# Altium schematic sheet USB_TYPEC_Connector.SchDoc
size A3; Date: 07.08.2025; CheckedBy: Own Check; CompanyName: No Company; DocumentNumber: ELK.PCB.0005.0005.A.A; Revision: V0.0.1; SheetNumber: 16; SheetTotal: 22
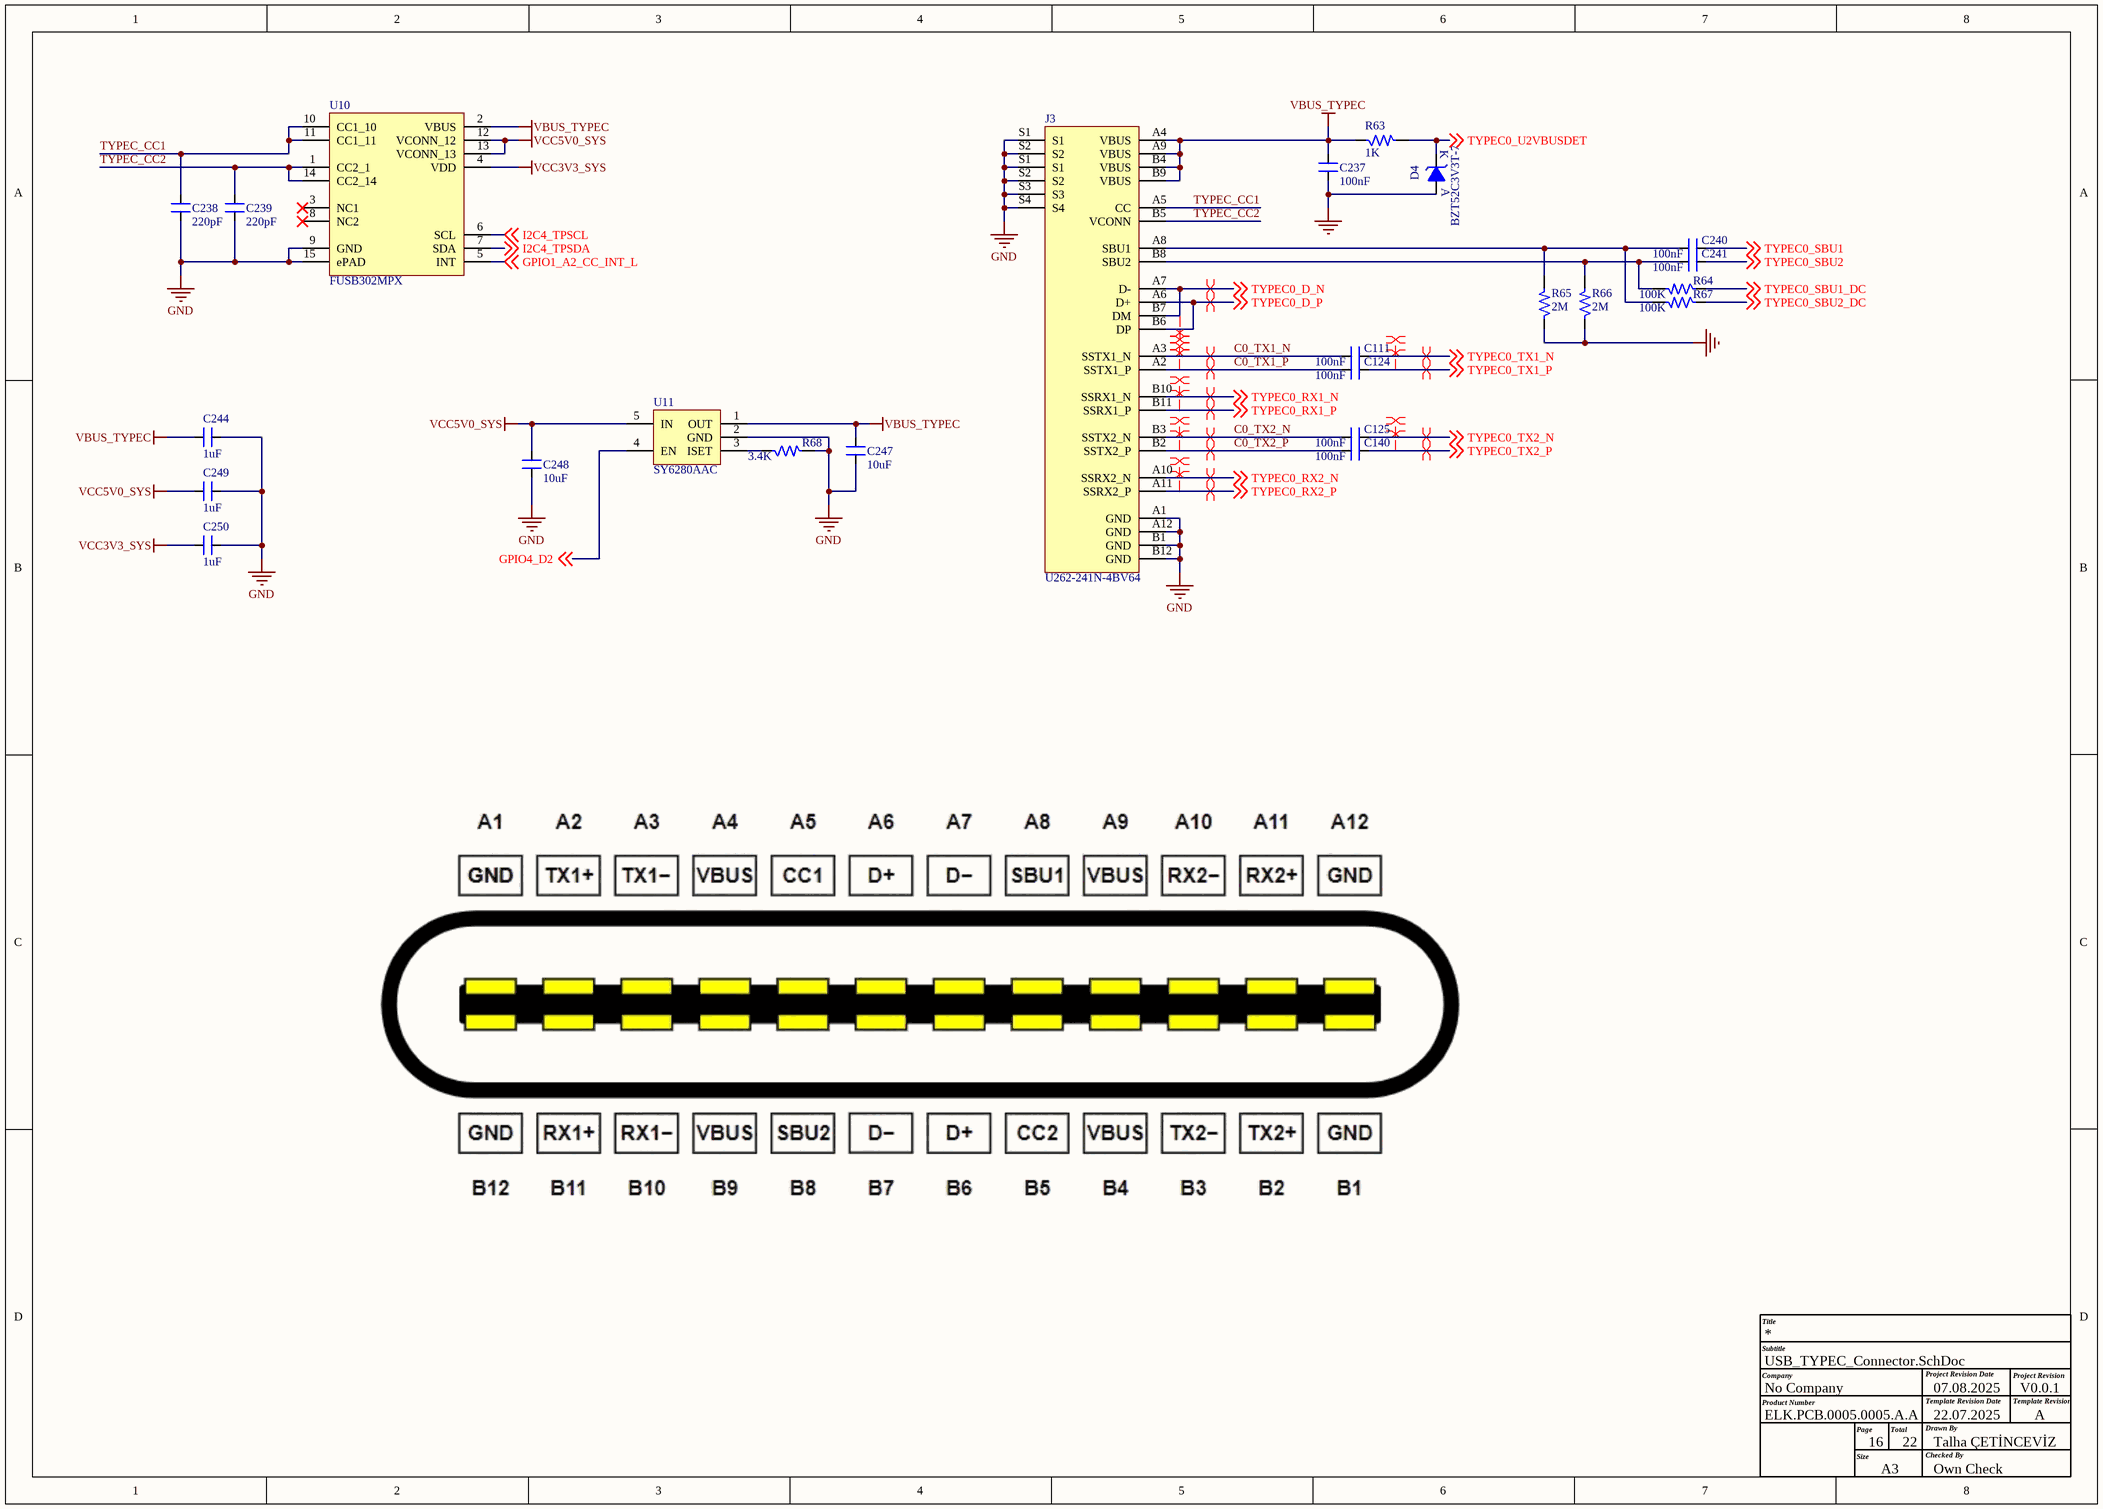
[diagram p0: USB_TYPEC_Connector.SchDoc]

## Parts
C111  100nF  [CAP_0402]
C124  100nF  [CAP_0402]
C125  100nF  [CAP_0402]
C140  100nF  [CAP_0402]
C237  100nF  [CAP_0603]
C238  220pF  [CAP_0402]
C239  220pF  [CAP_0402]
C240  100nF  [CAP_0402]
C241  100nF  [CAP_0402]
C244  1uF  [CAP_0402]
C247  10uF  [CAP_0402]
C248  10uF  [CAP_0402]
C249  1uF  [CAP_0402]
C250  1uF  [CAP_0402]
D4  BZT52C3V3T-7  [DIO_SOD523]
J3  U262-241N-4BV64  [CON24_19.64_U262-241N-4BV64_TH_RA]
R63  1K  [RES_0402]
R64  100K  [RES_0402]
R65  2M  [RES_0402]
R66  2M  [RES_0402]
R67  100K  [RES_0402]
R68  3.4K  [RES_0402]
U10  FUSB302MPX  [MLP-14_98.4X98.4_SMD]
U11  SY6280AAC  [SOT23-5]

## Nets
GND: C237.1 C238.1 C239.1 C244.1 C247.1 C248.1 C249.1 C250.1 D4.A J3.A1(GND) J3.A12(GND) J3.B1(GND) J3.B12(GND) J3.S1 J3.S2 J3.S3 J3.S4 R65.1 R66.1 R68.2 U10.9(GND) U10.15(ePAD) U11.2(GND)
VBUS_TYPEC: C237.2 C244.2 C247.2 J3.A4(VBUS) J3.A9(VBUS) J3.B4(VBUS) J3.B9(VBUS) R63.1 U10.2(VBUS) U11.1(OUT)
VCC3V3_SYS: C250.2 U10.4(VDD)
VCC5V0_SYS: C248.2 C249.2 U10.12(VCONN_12) U10.13(VCONN_13) U11.5(IN)
C0_TX1_N: C111.1 J3.A3(SSTX1_N)
C0_TX1_P: C124.1 J3.A2(SSTX1_P)
C0_TX2_N: C125.1 J3.B3(SSTX2_N)
C0_TX2_P: C140.1 J3.B2(SSTX2_P)
GPIO1_A2_CC_INT_L: U10.5(INT) ; off-sheet GPIO1_A2_CC_INT_L
GPIO4_D2: U11.4(EN) ; off-sheet GPIO4_D2
I2C4_TPSCL: U10.6(SCL) ; off-sheet I2C4_TPSCL
I2C4_TPSDA: U10.7(SDA) ; off-sheet I2C4_TPSDA
TYPEC0_D_N: J3.A7(D-) J3.B7(DM) ; off-sheet TYPEC0_D_N
TYPEC0_D_P: J3.A6(D+) J3.B6(DP) ; off-sheet TYPEC0_D_P
TYPEC0_RX1_N: J3.B10(SSRX1_N) ; off-sheet TYPEC0_RX1_N
TYPEC0_RX1_P: J3.B11(SSRX1_P) ; off-sheet TYPEC0_RX1_P
TYPEC0_RX2_N: J3.A10(SSRX2_N) ; off-sheet TYPEC0_RX2_N
TYPEC0_RX2_P: J3.A11(SSRX2_P) ; off-sheet TYPEC0_RX2_P
TYPEC0_SBU1: C240.2 ; off-sheet TYPEC0_SBU1
TYPEC0_SBU1_DC: R64.1 ; off-sheet TYPEC0_SBU1_DC
TYPEC0_SBU2: C241.2 ; off-sheet TYPEC0_SBU2
TYPEC0_SBU2_DC: R67.1 ; off-sheet TYPEC0_SBU2_DC
TYPEC0_TX1_N: C111.2 ; off-sheet TYPEC0_TX1_N
TYPEC0_TX1_P: C124.2 ; off-sheet TYPEC0_TX1_P
TYPEC0_TX2_N: C125.2 ; off-sheet TYPEC0_TX2_N
TYPEC0_TX2_P: C140.2 ; off-sheet TYPEC0_TX2_P
TYPEC0_U2VBUSDET: D4.K R63.2 ; off-sheet TYPEC0_U2VBUSDET
TYPEC_CC1: C238.2 J3.A5(CC) U10.10(CC1_10) U10.11(CC1_11)
TYPEC_CC2: C239.2 J3.B5(VCONN) U10.1(CC2_1) U10.14(CC2_14)
NetC240_1: C240.1 J3.A8(SBU1) R65.2 R67.2
NetC241_1: C241.1 J3.B8(SBU2) R64.2 R66.2
NetR68_1: R68.1 U11.3(ISET)

Not connected (* = marked no-connect by the designer): U10 3(NC1)* 8(NC2)*

## Layout directives
differential pair; differential pair class DIFF90_USBTYPEC: C0_TX1_N, C0_TX1_P, C0_TX2_N, C0_TX2_P, TYPEC0_D_N, TYPEC0_D_P, TYPEC0_RX1_N, TYPEC0_RX1_P, TYPEC0_RX2_N, TYPEC0_RX2_P, TYPEC0_TX1_N, TYPEC0_TX1_P, TYPEC0_TX2_N, TYPEC0_TX2_P
net class TYPEC0 SIG. GROUP; net class DIFF_PAIR_CLASS: C0_TX1_N, C0_TX1_P, C0_TX2_N, C0_TX2_P, TYPEC0_D_N, TYPEC0_D_P, TYPEC0_RX1_N, TYPEC0_RX1_P, TYPEC0_RX2_N, TYPEC0_RX2_P, TYPEC0_TX1_N, TYPEC0_TX1_P, TYPEC0_TX2_N, TYPEC0_TX2_P

## Notes on the sheet
- Title
- Company
- Product Number
- Subtitle
- Project Revision Date
- Template Revision Date
- Project Revision
- Template Revision
- Size
- Page
- A3
- Total
- Checked By
- Drawn By
- 22.07.2025
- Talha ÇETİNCEVİZ
- A

## Library data of the parts
C111 C124 C125 C140 C240 C241 = CAP_100nF-25V-10%-0402: 0.1µF ±10% 25V Ceramic Capacitor X7R 0402 (1005 Metric); Manufacturer: Walsin Technology Corporation; Manufacturer Part Number: 0402B104K250CT; Case/Package: 0402; Supplier-1: Digikey
C237 = CAP_100nF-10V-5%-0603: 0.1µF ±10% 10V Ceramic Capacitor X7R 0603 (1608 Metric); Manufacturer: Yageo; Manufacturer Part Number: CC0603KRX7R6BB104; Case/Package: 0603; Supplier-1: Digikey
C238 C239 = CAP_220pF-10V-10%-0402: 220pF ±10% 10V Ceramic Capacitor X7R 0402 (1005 Metric); Manufacturer: KEMET; Manufacturer Part Number: C0402C221K8RAC7867; Case/Package: 0402; Supplier-1: Digikey
C244 C249 C250 = CAP_1uF-10V-10%-0402: 1µF ±10% 10V Ceramic Capacitor X6S 0402 (1005 Metric); Manufacturer: Murata Electronics; Manufacturer Part Number: GRT155C81A105KE01D; Case/Package: 0402; Supplier-1: Digikey
C247 C248 = CAP_10uF-10V-20%-0402: 10µF ±20% 10V Ceramic Capacitor X5R 0402 (1005 Metric); Manufacturer Part Number: CL05A106MP5NUNC; Manufacturer: Samsung Electro-Mechanics; Case/Package: 0402; Supplier-1: Digikey
D4 = DIO-Z_3.3V-300mW-SOD-523: Zener Diode 3.3V 300mW ±6% Surface Mount SOD-523; Manufacturer: Diodes Incorporated; Manufacturer Part Number: BZT52C3V3T-7; Case/Package: SOD523; Supplier-1: Digikey
J3 = CON-TYPEC_U262-241N-4BV64-SMD: USB - Type C Female 24 SMD USB Connectors RoHS; Manufacturer: XKB Connectivity; Manufacturer Part Number: U262-241N-4BV64; Case/Package: SMD; Supplier-1: LCSC
R63 = RES_1K-0.1W-1%-0402: 1 kOhms ±1% 0.1W, 1/10W Chip Resistor 0402 (1005 Metric) Anti-Sulfur Thin Film; Manufacturer: Vishay Beyschlag/Draloric/BC Components; Manufacturer Part Number: MCS04020C1001FE000; Case/Package: 0402; Supplier-1: Digikey
R64 R67 = RES_100K-0.1W-1%-0402: 100 kOhms ±1% 0.1W, 1/10W Chip Resistor 0402 (1005 Metric) Anti-Sulfur Thin Film; Manufacturer: Vishay Beyschlag/Draloric/BC Components; Manufacturer Part Number: MCS04020C1003FE000; Case/Package: 0402; Supplier-1: Digikey
R65 R66 = RES_2M-0.1W-1%-0402: 2 MOhms ±1% 0.1W, 1/10W Chip Resistor 0402 (1005 Metric) Anti-Sulfur Thin Film; Manufacturer: Vishay Beyschlag/Draloric/BC Components; Manufacturer Part Number: MCS04020C2004FE000; Case/Package: 0402; Supplier-1: Digikey
R68 = RES_3.4K-0.1W-1%-0402: 3.4 kOhms ±1% 0.1W, 1/10W Chip Resistor 0402 (1005 Metric) Automotive AEC-Q200 Thick Film; Manufacturer: Panasonic Electronic Components; Manufacturer Part Number: ERJ-2RKF3401X; Case/Package: 0402; Supplier-1: Digikey
U10 = IC_FUSB302MPX: USB Controller USB 3.1 USB Interface 14-MLP (2.5x2.5); Manufacturer: ON Semiconductor; Manufacturer Part Number: FUSB302MPX; Case/Package: 14-MLP; Supplier-1: Digikey
U11 = REG-ADJ_5.5V-5.5V-1.25A-SOT-23-5: SOT-23-5 PMIC - Power Distribution Switches RoHS; Manufacturer: Silergy Corp; Manufacturer Part Number: SY6280AAC; Case/Package: SOT-23-5; Supplier-1: LCSC